# Altium schematic sheet Interfaces.SchDoc
size A3; Organization: Altium Limited; Address1: L3, 12a Rodborough Rd; Address2: Frenchs Forest; Address3: NSW; Address4: Australia 2086
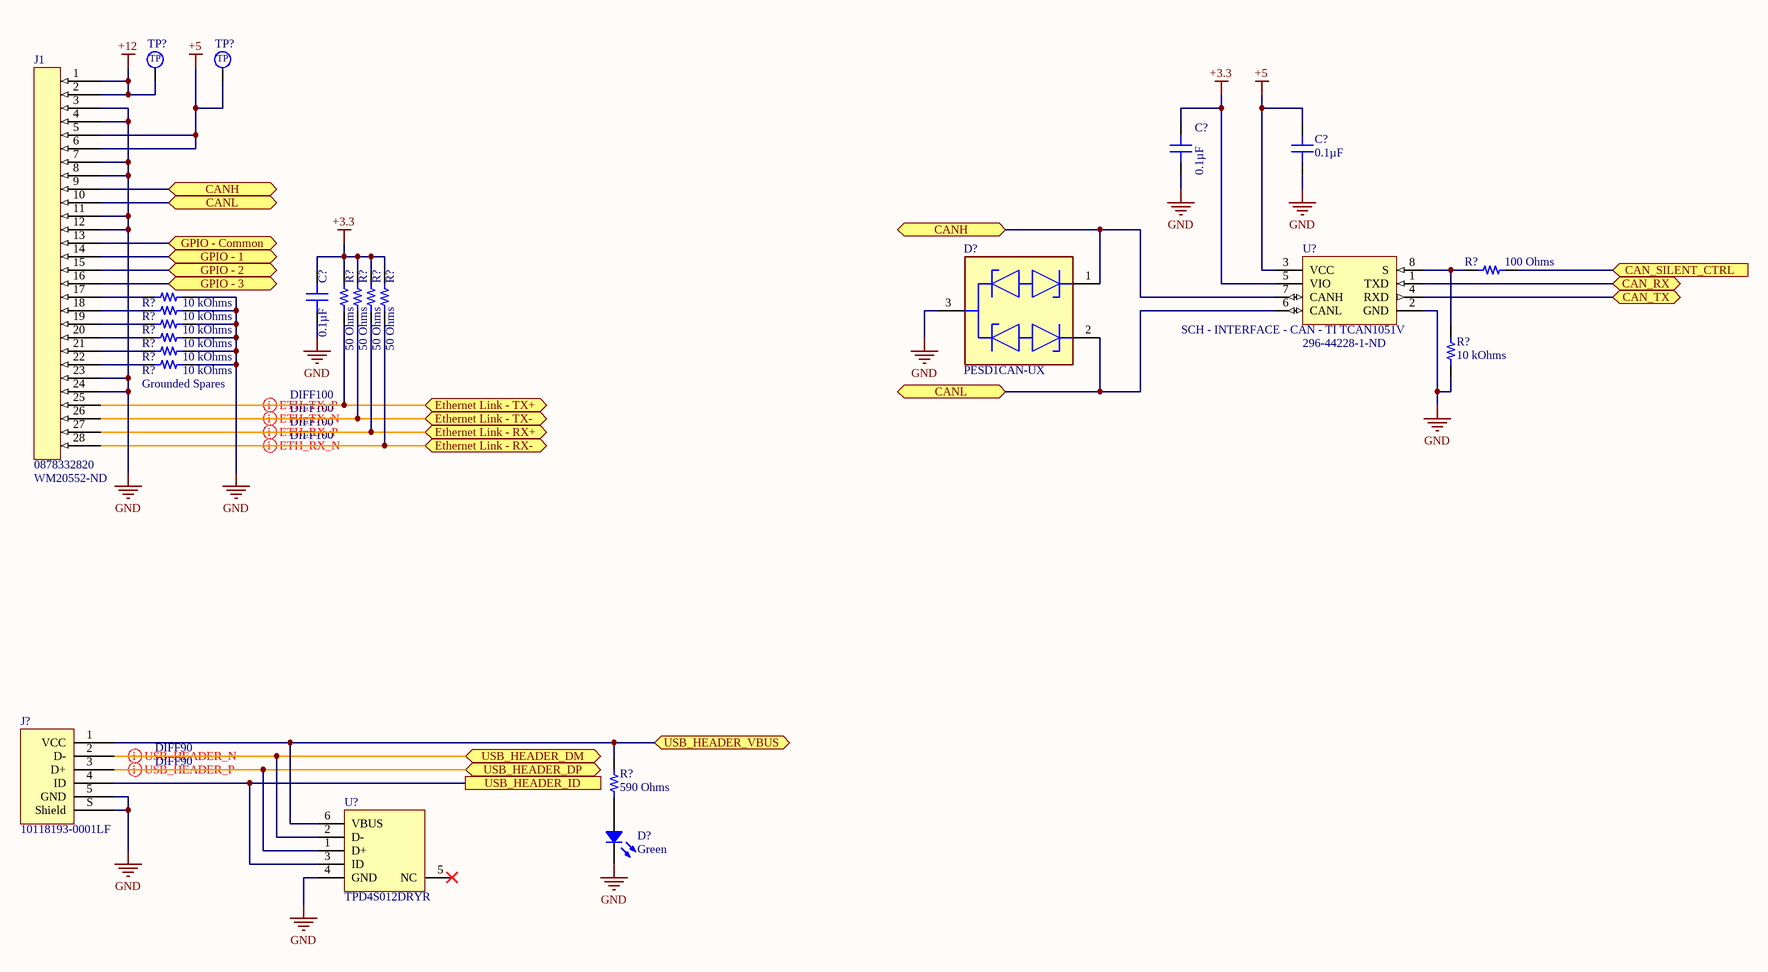
[diagram p0: Interfaces.SchDoc]

## Parts
(Parts that share a designator on the sheet are numbered #1, #2 ... from top to bottom, then left to right.)
C?#1  0.1µF  [CAP 0603_1608]
C?#2  0.1µF  [CAP 0603_1608]
C?#3  0.1µF  [CAP 0603_1608]
D?#1  PESD1CAN-UX  [FP-SOT323-MFG]
D?#2  Green  [LED 0603_1608 GREEN]
J1  0878332820  Supplier Part Number 1: WM20552-ND  [0878332820]
J?  10118193-0001LF  [FCI USB 10118193-0001LF]
R?#1  100 Ohms  [RES 0603_1608]
R?#2  10 kOhms  [RES 0603_1608]
R?#3  50 Ohms  [RES 0603_1608]
R?#4  50 Ohms  [RES 0603_1608]
R?#5  50 Ohms  [RES 0603_1608]
R?#6  50 Ohms  [RES 0603_1608]
R?#7  10 kOhms  [RES 0603_1608]
R?#8  10 kOhms  [RES 0603_1608]
R?#9  10 kOhms  [RES 0603_1608]
R?#10  10 kOhms  [RES 0603_1608]
R?#11  10 kOhms  [RES 0603_1608]
R?#12  10 kOhms  [RES 0603_1608]
R?#13  590 Ohms  [RES 0603_1608]
TP?#1  2.5mm_SMD_TestPoint  [2.5mm TestPoint]  (value not drawn)
TP?#2  2.5mm_SMD_TestPoint  [2.5mm TestPoint]  (value not drawn)
U?#1  SCH - INTERFACE - CAN - TI TCAN1051V  Supplier Part Number 1: 296-44228-1-ND  [PCB - LEADS - SOIC - TI SOIC-8]
U?#2  TPD4S012DRYR  [DRY0006A]

## Ports
CAN_RX (bidir), CAN_SILENT_CTRL (in), CAN_TX (bidir), CANH (bidir), CANL (bidir), Ethernet Link - RX+ (bidir), Ethernet Link - RX- (bidir), Ethernet Link - TX+ (bidir), Ethernet Link - TX- (bidir), GPIO - 1 (bidir), GPIO - 2 (bidir), GPIO - 3 (bidir), GPIO - Common (bidir), USB_HEADER_DM (bidir), USB_HEADER_DP (bidir), USB_HEADER_ID, USB_HEADER_VBUS (bidir)

## Nets
+3.3: C?#1.2 C?#3.2 R?#3.2 R?#4.2 R?#5.2 R?#6.2 U?#1.5(VIO)
+5: C?#2.2 J1.5 J1.6 TP?#2.1 U?#1.3(VCC)
+12: J1.1 J1.2 TP?#1.1
GND: C?#1.1 C?#2.1 C?#3.1 D?#1.3(common_cathode) D?#2.2 J1.3 J1.4 J1.7 J1.8 J1.11 J1.12 J1.23 J1.24 J?.5(GND) J?.S(Shield) R?#2.2 R?#7.2 R?#8.2 R?#9.2 R?#10.2 R?#11.1 R?#12.2 U?#1.2(GND) U?#2.4(GND)
CAN_RX: U?#1.1(TXD) ; port CAN_RX
CAN_SILENT_CTRL: R?#1.2 ; port CAN_SILENT_CTRL
CAN_TX: U?#1.4(RXD) ; port CAN_TX
CANH: D?#1.1(cathode_1) J1.9 U?#1.7(CANH) ; port CANH
CANL: D?#1.2(cathode_2) J1.10 U?#1.6(CANL) ; port CANL
Ethernet Link - RX+: J1.27 R?#5.1 ; port Ethernet Link - RX+
Ethernet Link - RX-: J1.28 R?#6.1 ; port Ethernet Link - RX-
Ethernet Link - TX+: J1.25 R?#3.1 ; port Ethernet Link - TX+
Ethernet Link - TX-: J1.26 R?#4.1 ; port Ethernet Link - TX-
GPIO - 1: J1.14 ; port GPIO - 1
GPIO - 2: J1.15 ; port GPIO - 2
GPIO - 3: J1.16 ; port GPIO - 3
GPIO - Common: J1.13 ; port GPIO - Common
USB_HEADER_DM: J?.2(D-) U?#2.2(D-) ; port USB_HEADER_DM
USB_HEADER_DP: J?.3(D+) U?#2.1(D+) ; port USB_HEADER_DP
USB_HEADER_ID: J?.4(ID) U?#2.3(ID) ; port USB_HEADER_ID
USB_HEADER_VBUS: J?.1(VCC) R?#13.2 U?#2.6(VBUS) ; port USB_HEADER_VBUS
NetD?#2_1: D?#2.1 R?#13.1
NetJ1_17: J1.17 R?#2.1
NetJ1_18: J1.18 R?#7.1
NetJ1_19: J1.19 R?#8.1
NetJ1_20: J1.20 R?#9.1
NetJ1_21: J1.21 R?#10.1
NetJ1_22: J1.22 R?#12.1
NetR?#1_1: R?#1.1 R?#11.2 U?#1.8(S)

Not connected (* = marked no-connect by the designer): U?#2 5(NC)*

## Layout directives
differential pair; differential pair class DIFF100: Ethernet Link - RX+, Ethernet Link - RX-, Ethernet Link - TX+, Ethernet Link - TX-
differential pair; differential pair class DIFF90: USB_HEADER_DM, USB_HEADER_DP

## Notes on the sheet
- (near R?#12) Grounded Spares
- Title
- Size:
- Date:
- A3
- Number:
- Time:
- Revision:
- Sheet
- of
- File:
- (in symbol 2.5mm_SMD_TestPoint) TP

## Library data of the parts
C?#1-C?#3 = CL10B104KA8WPNC: CAP CER 0.1UF 25V X7R 0603; Manufacturer: Samsung Electro-Mechanics; Tolerance: ±10%; Part Number: CL10B104KA8WPNC; Value: 0.1µF; Applications: Automotive; Capacitance: 0.1µF; ComponentLink1Description: Datasheet; ComponentLink1URL: http://www.samsungsem.com/kr/support/product-search/mlcc/CL10B104KA8WPNC.jsp; ComponentLink2Description: DigiKey Link; ComponentLink2URL: http://digikey.com/product-detail/en/samsung-electro-mechanics/CL10B104KA8WPNC/1276-6717-1-ND/5961576; Device Package: 0603 (1608 Metric); Features: Open Mode; LastUpdated: 9/2/2020 1:03:30 AM; Lifecycle Status: Active; Minimum Order: 1; Mounting Type: Surface Mount, MLCC; Operating Temperature: -55°C ~ 125°C; Package / Case: 0603 (1608 Metric); Packaging: TapeAndReel; PartId: 5631; Part Status: Active; Price: 0.02; Ratings: AEC-Q200; Series: CL; Size / Dimension: 0.063" L x 0.031" W (1.60mm x 0.80mm); Supplier 1: DigiKey; Supplier Part Number 1: 1276-6717-1-ND; Temperature Coefficient: X7R; Thickness (Max): 0.035" (0.90mm); Voltage - Rated: 25V
D?#1 = CMP-14436-000006-1: TVS DIODE 24V 50V SC70-3
D?#2 = LTST-C193KGKT-5A: LED GREEN CLEAR CHIP SMD; Manufacturer: Lite-On Inc.; Configuration: Standard; Current - Test: 5mA; Lens Color: Colorless; Lens Size: 1.15mm x 0.80mm; Lens Style: Rectangle with Flat Top; Millicandela Rating: 16.25mcd; Viewing Angle: 130°; Voltage - Forward (Vf) (Typ): 2V; Wavelength - Dominant: 572nm; Wavelength - Peak: 574nm; Part Number: LTST-C193KGKT-5A; Color: Green; ComponentLink1Description: Datasheet; ComponentLink1URL: http://optoelectronics.liteon.com/upload/download/DS22-2007-0094/LTST-C193KGKT-5A.PDF; ComponentLink2Description: DigiKey Link; ComponentLink2URL: http://digikey.com/product-detail/en/lite-on-inc/LTST-C193KGKT-5A/160-1828-1-ND/2356247; Device Package: 0603 (1608 Metric); Height (Max): 0.45mm; LastUpdated: 9/2/2020 1:20:41 AM; Lens Transparency: Clear; Lifecycle Status: Active; Minimum Order: 1; Mounting Type: Surface Mount; Package / Case: 0603 (1608 Metric); Packaging: TapeAndReel; PartId: 694; Part Status: Active; Price: 0.06; Series: -; Size / Dimension: 1.60mm L x 0.80mm W; Supplier 1: DigiKey; Supplier Part Number 1: 160-1828-1-ND; Supplier Device Package: Chip LED; Value: Green
J? = 10118193-0001LF: CONN RCPT USB2.0 MICRO B SMD R/A; Manufacturer: Amphenol ICC (FCI); Connector Type: USB - micro B; Current Rating (Amps): 1.8A per Contact; Gender: Receptacle; Mating Cycles: 10000; Number of Contacts: 5; Number of Ports: 1; Shielding: Shielded; Voltage - Rated: 100VAC; Part Number: 10118193-0001LF; ComponentLink1Description: Datasheet; ComponentLink1URL: https://cdn.amphenol-icc.com/media/wysiwyg/files/documentation/datasheet/inputoutput/io_usb_micro.pdf; ComponentLink2Description: DigiKey Link; ComponentLink2URL: //digikey.com/product-detail/en/amphenol-icc-fci/10118193-0001LF/609-4616-2-ND/2785388; Features: Solder Retention; LastUpdated: 12/9/2019 8:51:28 PM; Lifecycle Status: 0; Minimum Order: 1; Mounting Feature: Horizontal; Mounting Type: Surface Mount, Right Angle; Through Hole; Operating Temperature: -30°C ~ 80°C; Packaging: TapeAndReel; Part Status: Active; Price: 0.21; Series: -; Specifications: USB 2.0; Supplier 1: DigiKey; Supplier Part Number 1: 609-4616-2-ND; Termination: Solder
R?#1 = RMCF0603FG100R: RES 100 OHM 1% 1/10W 0603; Manufacturer: Stackpole Electronics Inc; Power (Watts): 0.1W, 1/10W; Temperature Coefficient: ±100ppm/°C; Part Number: RMCF0603FG100R; Value: 100 Ohms; ComponentLink1Description: Datasheet; ComponentLink1URL: https://www.seielect.com/catalog/sei-rmcf_rmcp.pdf; ComponentLink2Description: DigiKey Link; ComponentLink2URL: http://digikey.com/product-detail/en/stackpole-electronics-inc/RMCF0603FG100R/RMCF0603FG100RCT-ND/4425033; Composition: Thick Film; Device Package: 0603 (1608 Metric); Features: Automotive AEC-Q200; Height - Seated (Max): 0.022" (0.55mm); LastUpdated: 9/2/2020 1:09:39 AM; Lifecycle Status: Active; Minimum Order: 1; Number of Terminations: 2; Operating Temperature: -55°C ~ 155°C; Package / Case: 0603 (1608 Metric); Packaging: CutTape; PartId: 24036; Part Status: Active; Price: 0.10; Ratings: AEC-Q200; Resistance: 100 Ohms; Series: RMCF; Size / Dimension: 0.061" L x 0.031" W (1.55mm x 0.80mm); Supplier 1: DigiKey; Supplier Part Number 1: RMCF0603FG100RCT-ND; Supplier Device Package: 0603; Tolerance: ±1%
R?#2 R?#7-R?#12 = RMCF0603JT10K0: RES 10K OHM 5% 1/10W 0603; Manufacturer: Stackpole Electronics Inc; Power (Watts): 0.1W, 1/10W; Temperature Coefficient: ±200ppm/°C; Part Number: RMCF0603JT10K0; Value: 10 kOhms; ComponentLink1Description: Datasheet; ComponentLink1URL: https://www.seielect.com/catalog/sei-packaging.pdf; ComponentLink2Description: DigiKey Link; ComponentLink2URL: http://digikey.com/product-detail/en/stackpole-electronics-inc/RMCF0603JT10K0/RMCF0603JT10K0CT-ND/1943191; Composition: Thick Film; Device Package: 0603 (1608 Metric); Features: Automotive AEC-Q200; Height - Seated (Max): 0.022" (0.55mm); LastUpdated: 8/30/2020 8:48:45 PM; Lifecycle Status: Active; Minimum Order: 1; Number of Terminations: 2; Operating Temperature: -55°C ~ 155°C; Package / Case: 0603 (1608 Metric); Packaging: CutTape; PartId: 25659; Part Status: Active; Price: 0.10; Ratings: AEC-Q200; Resistance: 10 kOhms; Series: RMCF; Size / Dimension: 0.061" L x 0.031" W (1.55mm x 0.80mm); Supplier 1: DigiKey; Supplier Part Number 1: RMCF0603JT10K0CT-ND; Supplier Device Package: 0603; Tolerance: ±5%
R?#3-R?#6 = CRCW060350R0FKEA: RES SMD 50 OHM 1% 1/10W 0603; Manufacturer: Vishay Dale; Power (Watts): 0.1W, 1/10W; Temperature Coefficient: ±100ppm/°C; Part Number: CRCW060350R0FKEA; Value: 50 Ohms; ComponentLink1Description: Datasheet; ComponentLink1URL: http://www.vishay.com/docs/20035/dcrcwe3.pdf; ComponentLink2Description: DigiKey Link; ComponentLink2URL: http://digikey.com/product-detail/en/vishay-dale/CRCW060350R0FKEA/541-3318-1-ND/6684924; Composition: Thick Film; Device Package: 0603 (1608 Metric); Features: Automotive AEC-Q200; Height - Seated (Max): 0.020" (0.50mm); LastUpdated: 9/2/2020 1:09:40 AM; Lifecycle Status: Active; Minimum Order: 1; Number of Terminations: 2; Operating Temperature: -55°C ~ 155°C; Package / Case: 0603 (1608 Metric); Packaging: CutTape; PartId: 23780; Part Status: Active; Price: 0.10; Ratings: AEC-Q200; Resistance: 50 Ohms; Series: CRCW; Size / Dimension: 0.061" L x 0.033" W (1.55mm x 0.85mm); Supplier 1: DigiKey; Supplier Part Number 1: 541-3318-1-ND; Supplier Device Package: 0603; Tolerance: ±1%
R?#13 = RMCF0603FT590R: RES 590 OHM 1% 1/10W 0603; Manufacturer: Stackpole Electronics Inc; Power (Watts): 0.1W, 1/10W; Temperature Coefficient: ±100ppm/°C; Part Number: RMCF0603FT590R; Value: 590 Ohms; ComponentLink1Description: Datasheet; ComponentLink1URL: https://www.seielect.com/catalog/sei-rmcf_rmcp.pdf; ComponentLink2Description: DigiKey Link; ComponentLink2URL: http://digikey.com/product-detail/en/stackpole-electronics-inc/RMCF0603FT590R/RMCF0603FT590RCT-ND/2418096; Composition: Thick Film; Device Package: 0603 (1608 Metric); Features: Automotive AEC-Q200; Height - Seated (Max): 0.022" (0.55mm); LastUpdated: 9/2/2020 1:09:40 AM; Lifecycle Status: Active; Minimum Order: 1; Number of Terminations: 2; Operating Temperature: -55°C ~ 155°C; Package / Case: 0603 (1608 Metric); Packaging: CutTape; PartId: 23847; Part Status: Active; Price: 0.10; Ratings: AEC-Q200; Resistance: 590 Ohms; Series: RMCF; Size / Dimension: 0.061" L x 0.031" W (1.55mm x 0.80mm); Supplier 1: DigiKey; Supplier Part Number 1: RMCF0603FT590RCT-ND; Supplier Device Package: 0603; Tolerance: ±1%
U?#2 = CMP-0326-00038-3: USB ESD Solution with Power Clamp, 4 Channels, -40 to +85 degC, 6-pin SON (DRY), Green (RoHS & no Sb/Br); Manufacturer: Texas Instruments; IO Capacitance(Typ)(pF): 0.8; USB High Speed: TRUE; IEC 61000-4-2 Air-Gap(+/- kV): 10; Breakdown Voltage(Min)(V): 6; PackageDescription: 6-Pin Plastic Small Outline No-Lead, 1 x 1.45 x 0.6 mm Body, 0.5 mm Pitch; ComponentLink2URL: http://www.ti.com/general/docs/lit/getliterature.tsp?genericPartNumber=TPD4S012&fileType=pdf; PackageVersion: revF, Dec-2011; ComponentLink3URL: SamplesURL:http://www.ti.com/product/tpd4s012#samples; ComponentLink2Description: Datasheet; IEC 61000-4-2 Contact(+/- kV): 10; DatasheetVersion: SLVS928A; PackageReference: DRY0006A; ComponentLink3Description: URL Link1; Mounting Technology: Surface Mount; PartNumber: TPD4S012DRYR; ComponentLink1Description: Manufacturer URL; SubFamily: ESD Solution; IO Leakage Current(nA): 10; ComponentLink1URL: http://www.ti.com/; Eco-Plan: Green (RoHS & no Sb/Br)
J1 = 0878332820: Supplier 1: Digi-Key
U?#1 = SCH - INTERFACE - CAN - TI TCAN1051V: Supplier 1: Digi-Key